# EAGLE design esquematico (EAGLE 9.6.2)
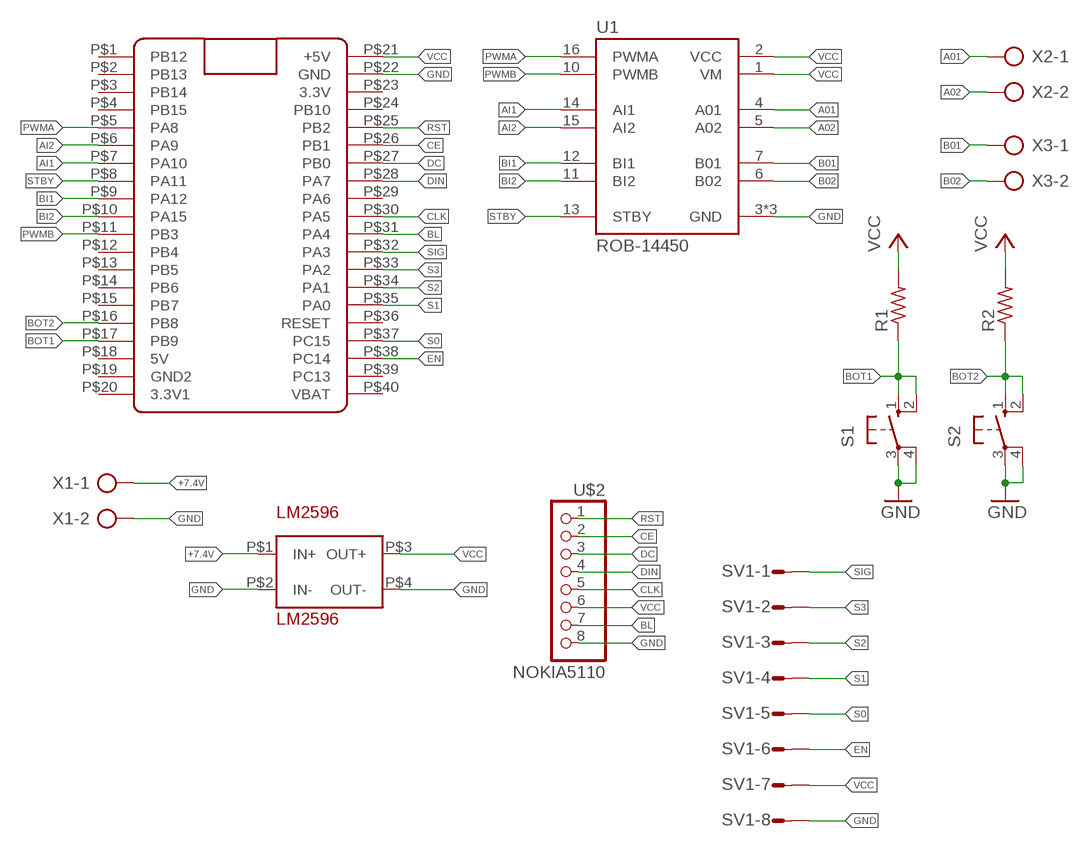
[diagram p0: schematic, sheet 1]

## Parts
R1  R-US_0204/7  [0204/7]
R2  R-US_0204/7  [0204/7]
S1  10-XX  [B3F-10XX]
S2  10-XX  [B3F-10XX]
SV1  S08P  [S08P]
U1  ROB-14450  [MODULE_ROB-14450]
U$1  BLUE_PILL  [BLUE_PILL]
U$2  NOKIA5110  [1X08]
U$3  LM2596  [LM2596]
X1  AK300/2  [AK300/2]
X2  AK300/2  [AK300/2]
X3  AK300/2  [AK300/2]

## Nets
+7.4V: U$3.P$1(IN+) X1.1
A01: U1.4(A01) X2.1
A02: U1.5(A02) X2.2
AI1: U1.14(AI1) U$1.P$7(PA10)
AI2: U1.15(AI2) U$1.P$6(PA9)
B01: U1.7(B01) X3.1
B02: U1.6(B02) X3.2
BI1: U1.12(BI1) U$1.P$9(PA12)
BI2: U1.11(BI2) U$1.P$10(PA15)
BL: U$1.P$31(PA4) U$2.7
BOT1: R1.1 S1.1(S) S1.2(S1) U$1.P$17(PB9)
BOT2: R2.1 S2.1(S) S2.2(S1) U$1.P$16(PB8)
CE: U$1.P$26(PB1) U$2.2
CLK: U$1.P$30(PA5) U$2.5
DC: U$1.P$27(PB0) U$2.3
DIN: U$1.P$28(PA7) U$2.4
EN: SV1.6 U$1.P$38(PC14)
GND: S1.3(P) S1.4(P1) S2.3(P) S2.4(P1) SV1.8 U1.3(GND) U1.8(GND) U1.9(GND) U$1.P$22(GND) U$2.8 U$3.P$2(IN-) U$3.P$4(OUT-) X1.2
PWMA: U1.16(PWMA) U$1.P$5(PA8)
PWMB: U1.10(PWMB) U$1.P$11(PB3)
RST: U$1.P$25(PB2) U$2.1
S0: SV1.5 U$1.P$37(PC15)
S1: SV1.4 U$1.P$35(PA0)
S2: SV1.3 U$1.P$34(PA1)
S3: SV1.2 U$1.P$33(PA2)
SIG: SV1.1 U$1.P$32(PA3)
STBY: U1.13(STBY) U$1.P$8(PA11)
VCC: R1.2 R2.2 SV1.7 U1.1(VM) U1.2(VCC) U$1.P$21(+5V) U$2.6 U$3.P$3(OUT+)
Unconnected: U$1.P$1(PB12) U$1.P$2(PB13) U$1.P$3(PB14) U$1.P$4(PB15) U$1.P$12(PB4) U$1.P$13(PB5) U$1.P$14(PB6) U$1.P$15(PB7) U$1.P$18(5V) U$1.P$19(GND2) U$1.P$20(3.3V1) U$1.P$23(3.3V) U$1.P$24(PB10) U$1.P$29(PA6) U$1.P$36(RESET) U$1.P$39(PC13) U$1.P$40(VBAT)

## Library data of the parts
R1 R2 = rcl:R-US_: RESISTOR, American symbol; SPICEPREFIX: R
S1 S2 = switch-omron:10-XX: OMRON SWITCH; MPN: B3F-1000; OC_FARNELL: 176432; OC_NEWARK: 36M3542
SV1 = con-amp-mt:S08P: AMP MT CONNECTOR; OC_FARNELL: unknown; OC_NEWARK: unknown
U1 = ROB-14450:ROB-14450: TB6612FNG Motor Controller/Driver Power Management Evaluation Board Check availability <https://pricing.snapeda.com/parts/ROB-14450/SparkFun%20Electronics/view-part?ref=eda>; AVAILABILITY: In Stock; DESCRIPTION: TB6612FNG Motor Controller/Driver Power Management Evaluation Board; MF: SparkFun Electronics; MP: ROB-14450; PACKAGE: None; PRICE: None; PURCHASE-URL: https://pricing.snapeda.com/search?q=ROB-14450&ref=eda
U$1 = BluePill:BLUE_PILL
U$2 = DRV8833:NOKIA5110
U$3 = DRV8833:LM2596
X1-X3 = con-ptr500:AK300/2: CONNECTOR; OC_FARNELL: unknown; OC_NEWARK: unknown

## Board
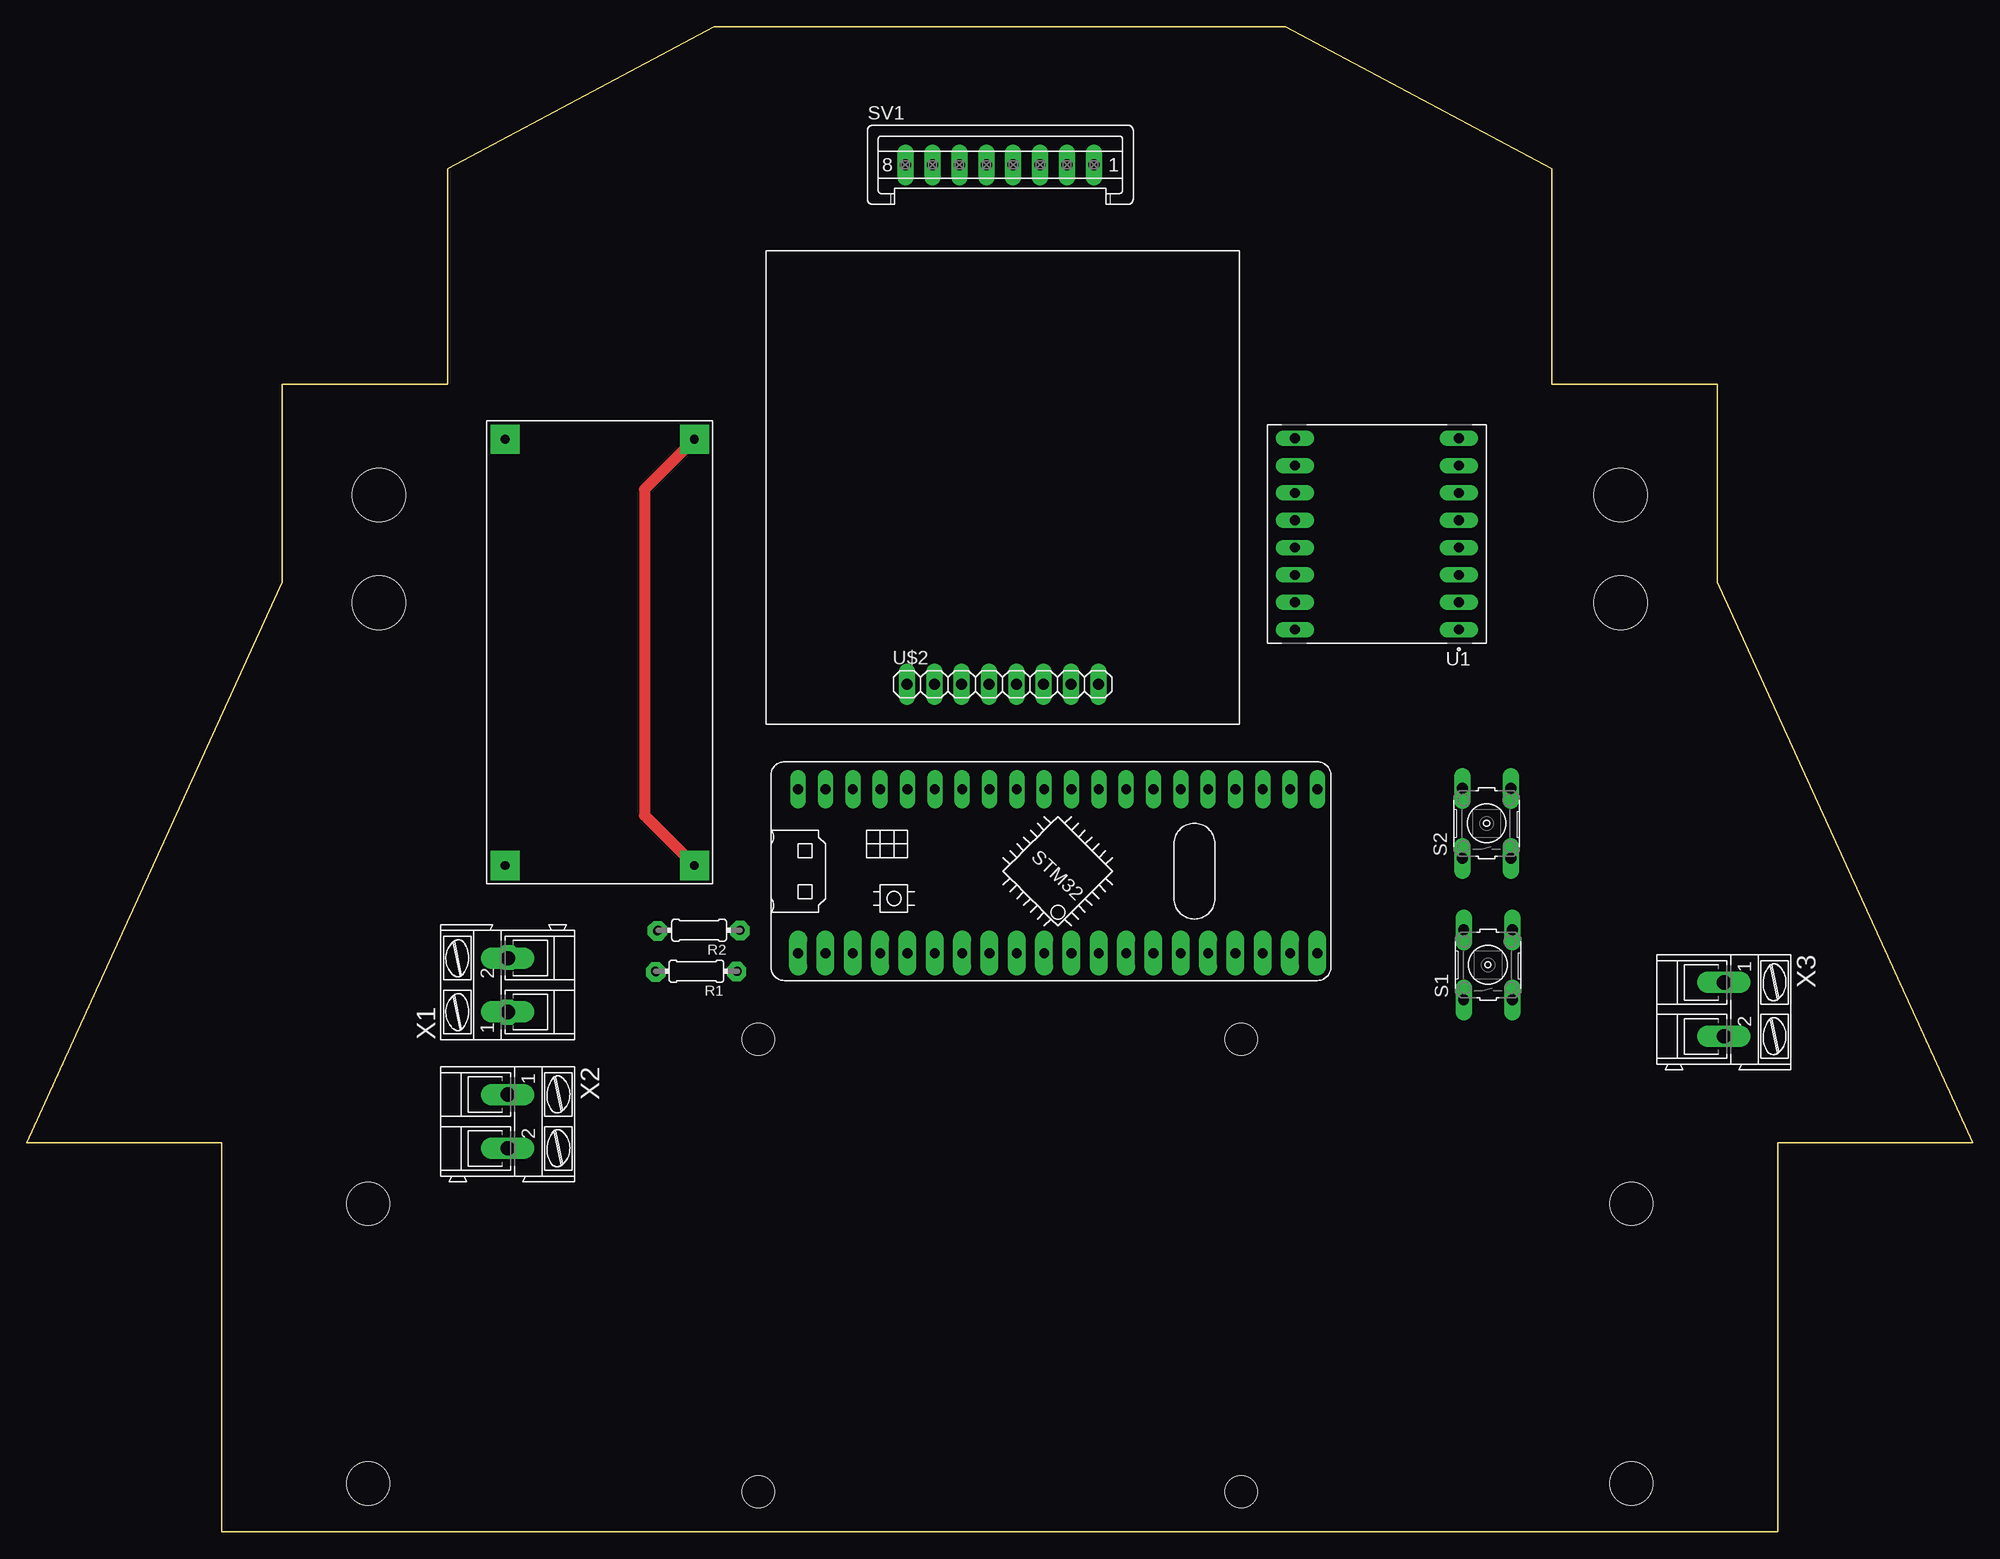
[diagram p1: board, top side]
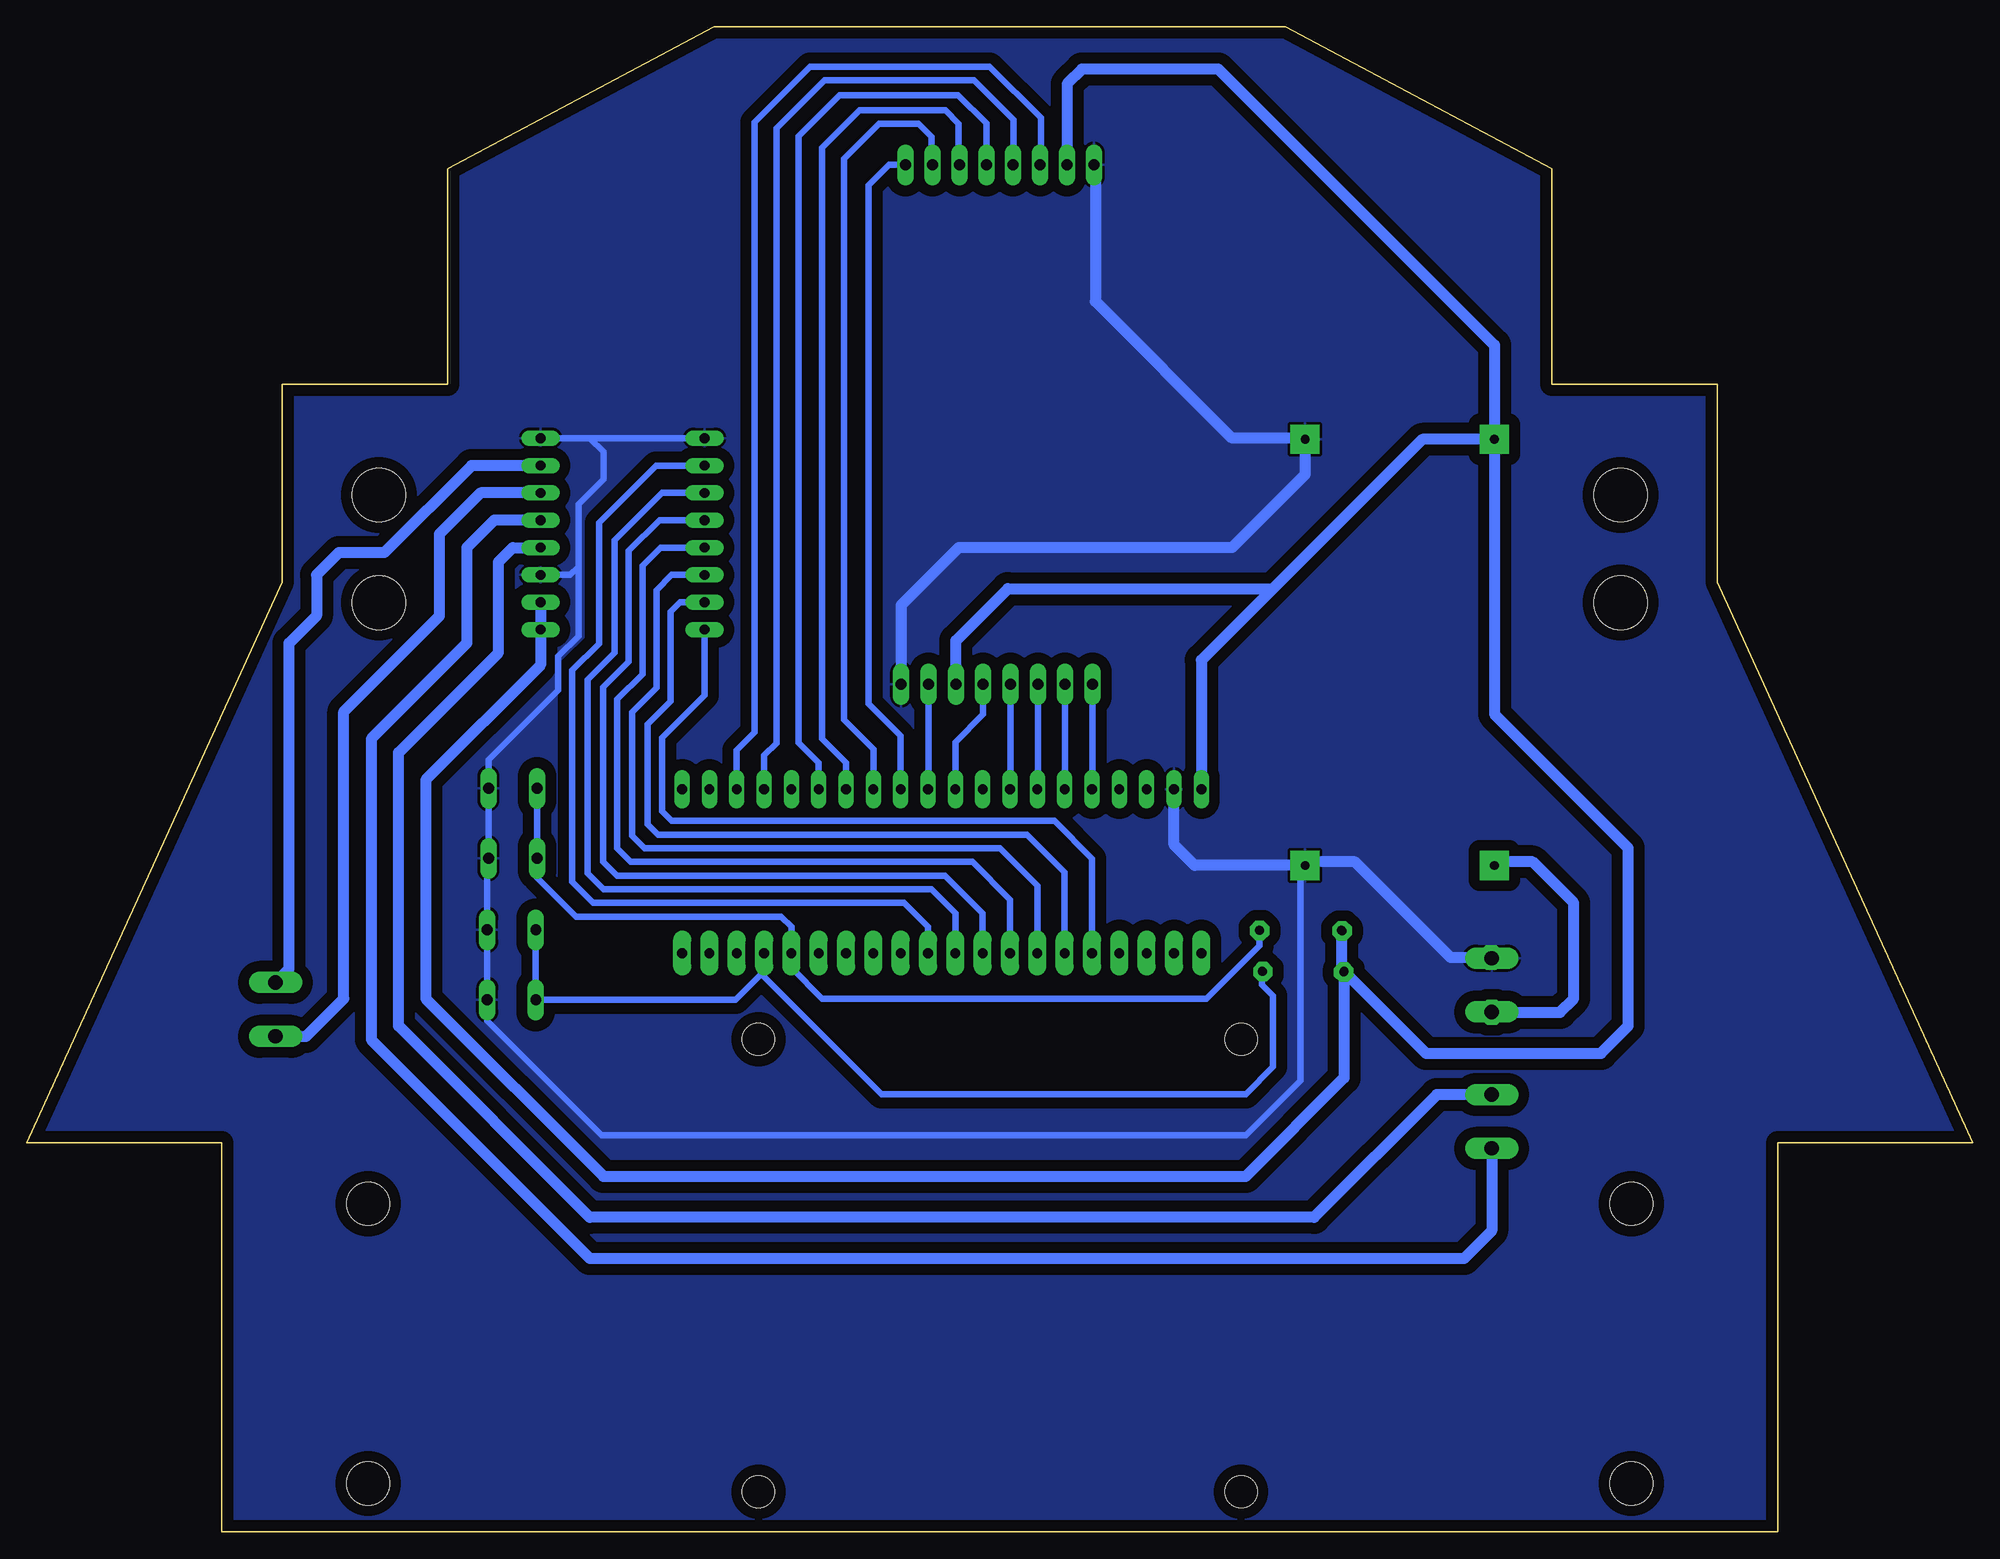
[diagram p2: board, bottom side, seen from below]

Size 180.83 x 139.81 mm. Coordinates in mm from the lower left corner, seen from the top.
Outline: 18.09,36.12 18.09,0 162.73,0 162.73,36.12 180.83,36.12 157.12,88.2 157.12,106.6 141.74,106.6 141.74,126.63 116.96,139.81 63.86,139.81 39.09,126.63 39.09,106.6 23.71,106.6 23.71,88.2 0,36.12 18.09,36.12
Copper layers (1*16): Top 0.035mm / dielectric 1.5mm / Bottom 0.035mm
Design rules "default *": minimum track width 6mil, minimum drill 0.35mm, track to track 6mil, track to pad 6mil, pad to pad 6mil, via to via 6mil, smd to smd 6mil, copper to edge 40mil, drill to drill 6mil, minimum pad ring 10mil, minimum via ring 8mil, stop-mask expansion 4mil, vias tented up to drill 0mil, thermal gap 10mil
Holes 4 mm at 149.12,4.47 31.71,4.47 31.71,30.47 149.12,30.47
Holes 5 mm at 32.72,86.32 148.11,86.32 148.11,96.32 32.72,96.32
Holes 3 mm at 67.99,45.76 67.99,3.7 112.84,45.76 112.84,3.7

### Footprints (pad centres in the part's own frame; a part is rotated, then mirrored left to right if it is on the bottom)
0204/7 = drill 0.813 octagon: 1 -3.81,0; 2 3.81,0
B3F-10XX = drill 1.016 long: 1 -3.251,2.261; 2 3.251,2.261; 3 -3.251,-2.261; 4 3.251,-2.261
S08P = drill 1.016 long: 1 8.75,0; 2 6.25,0; 3 3.75,0; 4 1.25,0; 5 -1.25,0; 6 -3.75,0; 7 -6.25,0; 8 -8.75,0
MODULE_ROB-14450 = drill 0.9 pad 1.422 long: 1 -7.62,8.89; 2 -7.62,6.35; 3 -7.62,3.81; 4 -7.62,1.27; 5 -7.62,-1.27; 6 -7.62,-3.81; 7 -7.62,-6.35; 8 -7.62,-8.89; 9 7.62,-8.89; 10 7.62,-6.35; 11 7.62,-3.81; 12 7.62,-1.27; 13 7.62,1.27; 14 7.62,3.81; 15 7.62,6.35; 16 7.62,8.89
BLUE_PILL = drill 0.9 pad 1.676 long: P$1 -7.62,15.24; P$2 -7.62,12.7; P$3 -7.62,10.16; P$4 -7.62,7.62; P$5 -7.62,5.08; P$6 -7.62,2.54; P$7 -7.62,0; P$8 -7.62,-2.54; P$9 -7.62,-5.08; P$10 -7.62,-7.62; P$11 -7.62,-10.16; P$12 -7.62,-12.7; P$13 -7.62,-15.24; P$14 -7.62,-17.78; P$15 -7.62,-20.32; P$16 -7.62,-22.86; P$17 -7.62,-25.4; P$18 -7.62,-27.94; P$19 -7.62,-30.48; P$20 -7.62,-33.02 | drill 0.9 pad 1.422 long: P$21 7.62,15.24; P$22 7.62,12.7; P$23 7.62,10.16; P$24 7.62,7.62; P$25 7.62,5.08; P$26 7.62,2.54; P$27 7.62,0; P$28 7.62,-2.54; P$29 7.62,-5.08; P$30 7.62,-7.62; P$31 7.62,-10.16; P$32 7.62,-12.7; P$33 7.62,-15.24; P$34 7.62,-17.78; P$35 7.62,-20.32; P$36 7.62,-22.86; P$37 7.62,-25.4; P$38 7.62,-27.94; P$39 7.62,-30.48; P$40 7.62,-33.02
1X08 = drill 1.016 long: 1 -9.89,-34.29; 2 -7.35,-34.29; 3 -4.81,-34.29; 4 -2.27,-34.29; 5 0.27,-34.29; 6 2.81,-34.29; 7 5.35,-34.29; 8 7.89,-34.29
LM2596 = drill 0.8 pad 2.7 square: P$1 1.7,19.3; P$2 1.7,1.7; P$3 41.3,19.3; P$4 41.3,1.7
AK300/2 = drill 1.321 long: 1 -2.515,0; 2 2.489,0

### Placement (x,y rotation side)
R1  62.22,52.07 180 top
R2  62.47,55.88 180 top
S1  135.79,52.66 90 top
S2  135.67,65.81 90 top
SV1  90.41,127 0 top
U1  125.47,92.71 180 top
U$1  86.92,61.37 90 top
U$2  91.68,113.03 0 top
U$3  63.74,60.2 90 top
X1  44.69,50.8 90 top
X2  44.69,38.1 270 top
X3  157.72,48.51 270 top

### Tracks (layer width: path | path; a pad name or v marks a point on that pad's centre or on a via)
+7.4V  (via drill 0.9 pad 2.3)
  Top 1.016: X1.1 v44.67,48.26
  Bottom 1.016: v44.67,48.26 38.34,48.26 37.07,49.53 37.07,58.42 40.88,62.23 44.11,62.23 U$3.P$1
A01
  Bottom 1.016: X2.1 49.8,40.62 61.2,29.21 128.51,29.21 146.29,46.99 146.29,72.39 137,81.68 137,90.11 135.68,91.44 U1.4
A02
  Bottom 1.016: U1.5 137.4,93.98 139.94,91.44 139.94,82.55 148.83,73.66 148.83,45.72 128.51,25.4 47.23,25.4 44.69,27.94 X2.2
AI1
  Bottom 0.61: U1.14 120.89,88.9 122.32,87.48 122.32,78.4 124.57,76.15 124.57,64.64 123.43,63.5 90.41,63.5 86.92,60 U$1.P$7
AI2
  Bottom 0.61: U1.15 118.05,86.16 117.29,86.16 117.08,86.36 120.1,86.36 121.01,85.45 121.01,77.17 123.14,75.04 123.14,65.75 122.16,64.77 87.87,64.77 84.38,61.27 U$1.P$6
B01
  Bottom 1.016: U1.7 139.52,99.06 147.61,90.97 151.85,90.97 153.91,88.9 153.91,85.09 156.45,82.55 156.45,52.3 X3.1
B02
  Bottom 1.016: U1.6 138.67,96.52 142.48,92.71 142.48,85.09 151.37,76.2 151.37,49.53 154.88,46.02 X3.2
BI1
  Bottom 0.61: U$1.P$9 92,57.46 95.49,60.96 125.97,60.96 127.26,62.24 127.26,78.45 124.9,80.81 124.9,91.14 122.05,93.98 U1.12
BI2
  Bottom 0.61: U$1.P$10 94.54,57.46 96.76,59.69 127.24,59.69 128.72,61.17 128.72,79.16 126.2,81.68 126.2,92.1 121.78,96.52 U1.11
BL
  Bottom 0.61: U$2.7 97.03,69.03 U$1.P$31
BOT1
  Bottom 0.61: S1.2 S1.1 114.98,49.41 112.32,52.07 | U$1.P$17 112.32,52.07 | R1.1 66.03,50.8 65.01,49.78 65.01,43.18 67.55,40.64 101.41,40.64 112.32,51.55 112.32,52.07
BOT2
  Bottom 0.61: S2.2 S2.1 133.41,60.77 129.78,57.15 110.73,57.15 109.78,56.19 U$1.P$16 109.78,52.38 106.92,49.53 71.19,49.53 66.28,54.43 R2.1
CE
  Bottom 0.61: U$2.2 84.33,69.03 U$1.P$26
CLK
  Bottom 0.61: U$2.5 91.95,75.93 94.54,73.35 U$1.P$30
DC
  Bottom 0.61: U$2.3 86.87,69.03 U$1.P$27
DIN
  Bottom 0.61: U$2.4 89.41,69.03 U$1.P$28
EN
  Bottom 0.61: SV1.6 86.6,127.06 86.6,131.38 91.35,136.13 108.04,136.13 113.21,130.96 113.21,74.26 114.86,72.61 U$1.P$38
GND  (via drill 0.9 pad 2.3)
  Top 1.016: X1.2 v44.75,53.34 | U$3.P$4 57.39,96.85 57.39,66.55 U$3.P$2
  Bottom 0.61: U1.8 128.51,101.6 | 128.51,101.6 U1.9 | U$3.P$2 62.47,61.47 62.47,41.91 67.55,36.83 127.42,36.83 138.05,47.46 S1.3 S1.4 138.05,62.44 S2.3 S2.4 137.93,71.71 131.44,78.2 131.44,81.32 129.55,83.21 129.55,89.67 | 133.09,88.55 U1.3 130.33,88.9 129.55,89.67 | 128.51,101.6 127.24,100.33 127.24,97.79 129.55,95.48 129.55,89.67
  Bottom 1.016: v44.75,53.34 48.5,53.34 57.39,62.23 61.71,62.23 U$3.P$2 72.3,61.9 74.22,63.81 U$1.P$22 | U$2.8 99.57,86.09 94.22,91.44 68.82,91.44 62.04,98.22 U$3.P$4 62.15,101.6 68.82,101.6 81.52,114.3 81.52,126.86 SV1.8
  pour Bottom (isolate 1.016): 23.71,88.2 0,36.12 18.1,36.12 18.1,0 162.73,0 162.73,36.12 180.83,36.12 157.12,88.2 157.12,106.6 141.74,106.6 141.74,126.63 116.96,139.81 63.86,139.81 39.09,126.63 39.09,106.6 23.71,106.6
N$1  (via drill 0.8 pad 1.8)
  other vias: 58.6,55.81
N$2  (via drill 0.8 pad 1.8)
  other vias: 66.27,55.85
N$3  (via drill 0.8 pad 1.8)
  other vias: 65.96,52.03
N$4  (via drill 0.8 pad 1.8)
  other vias: 58.45,52
PWMA
  Bottom 0.61: U1.16 117.85,77.69 121.79,73.75 121.79,66.94 120.89,66.04 85.33,66.04 81.84,62.54 U$1.P$5
PWMB
  Bottom 0.61: U1.10 122.34,99.06 127.66,93.73 127.66,82.5 130.14,80.02 130.14,60.36 128.2,58.42 99.3,58.42 97.08,56.19 U$1.P$11
RST
  Bottom 0.61: U$2.1 81.79,69.03 U$1.P$25
S0
  Bottom 0.61: SV1.5 89.14,127.02 89.14,131.19 92.82,134.86 106.72,134.86 111.18,130.4 111.18,73.26 112.32,72.12 U$1.P$37
S1
  Bottom 0.61: U$1.P$35 107.24,71.43 109.12,73.32 109.12,129.64 105.28,133.48 94.29,133.48 91.66,130.85 SV1.4
S2
  Bottom 0.61: U$1.P$34 104.7,71.43 106.92,73.66 106.92,128.57 103.44,132.05 95.47,132.05 94.22,130.81 94.22,127.06 SV1.3
S3
  Bottom 0.61: U$1.P$33 102.16,72.7 104.88,75.42 104.88,127.57 101.64,130.81 97.97,130.81 96.76,129.6 96.76,127.1 SV1.2
SIG
  Bottom 0.61: U$1.P$32 99.62,73.97 102.59,76.94 102.59,125.11 100.7,127 SV1.1
STBY
  Bottom 0.61: U1.13 121.91,91.44 123.63,89.73 123.63,79.68 125.97,77.34 125.97,63.49 124.7,62.23 92.95,62.23 89.46,58.73 U$1.P$8
VCC
  Bottom 1.016: U1.2 U1.1 133.09,80.52 143.75,69.85 143.75,49.53 127.24,33.02 67.55,33.02 58.41,42.16 R1.2 | R2.2 58.66,52.32 R1.2 | U$3.P$3 44.44,110.24 70.09,135.89 82.79,135.89 84.16,134.52 SV1.7 | 94.22,79.01 U$2.6 94.49,82.78 89.65,87.63 65.01,87.63 | U$3.P$3 44.44,75.95 31.99,63.5 31.99,46.99 34.53,44.45 50.79,44.45 R1.2 | U$3.P$3 51.15,101.5 65.01,87.63 | U$1.P$21 71.68,80.97 65.01,87.63